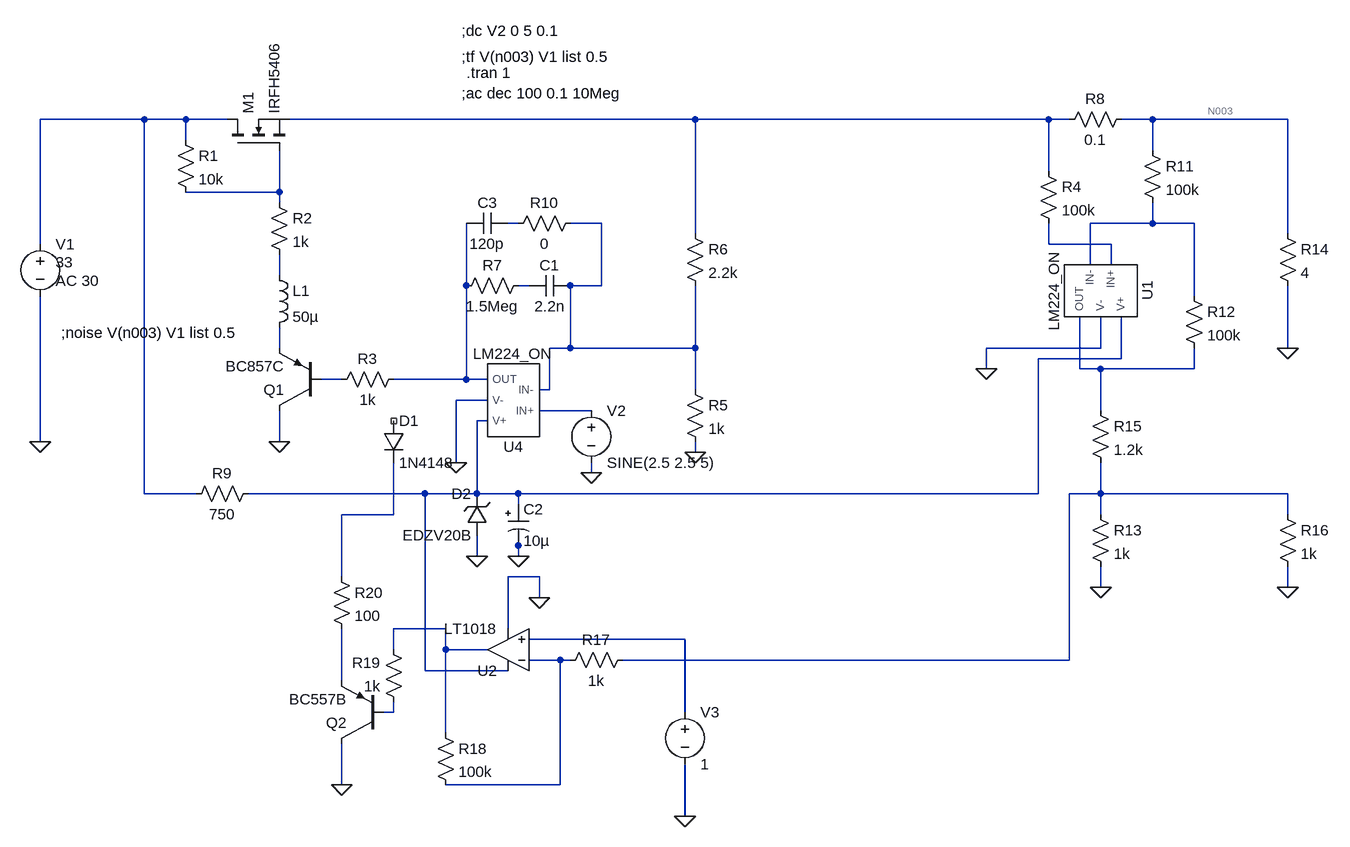
[diagram p0: schematic power_ac2.asc]
power_ac2.asc, the LTspice schematic file:
Version 4
SHEET 1 1520 1352
WIRE -672 96 -832 96
WIRE -608 96 -672 96
WIRE -544 96 -608 96
WIRE 176 96 -448 96
WIRE 720 96 176 96
WIRE 752 96 720 96
WIRE 880 96 832 96
WIRE 1088 96 880 96
WIRE -608 128 -608 96
WIRE 880 144 880 96
WIRE 720 176 720 96
WIRE -464 208 -464 144
WIRE -464 208 -608 208
WIRE -464 224 -464 208
WIRE -96 256 -112 256
WIRE 32 256 -16 256
WIRE 880 256 880 224
WIRE 880 256 784 256
WIRE 944 256 880 256
WIRE 176 272 176 96
WIRE 1088 272 1088 96
WIRE -832 288 -832 96
WIRE 720 288 720 256
WIRE 816 288 720 288
WIRE 784 320 784 256
WIRE 816 320 816 288
WIRE -464 336 -464 304
WIRE -176 352 -176 256
WIRE -80 352 -96 352
WIRE 32 352 32 256
WIRE 32 352 -16 352
WIRE 944 368 944 256
WIRE -464 448 -464 416
WIRE -16 448 -16 352
WIRE -16 448 -48 448
WIRE 176 448 176 352
WIRE 176 448 -16 448
WIRE 800 448 800 400
WIRE 800 448 624 448
WIRE 1088 448 1088 352
WIRE 832 464 832 400
WIRE 832 464 704 464
WIRE 624 480 624 448
WIRE 768 480 768 400
WIRE 800 480 768 480
WIRE 944 480 944 448
WIRE 944 480 800 480
WIRE -368 496 -400 496
WIRE -176 496 -176 352
WIRE -176 496 -288 496
WIRE -144 496 -176 496
WIRE -48 512 -48 448
WIRE -48 512 -64 512
WIRE 176 512 176 448
WIRE -144 528 -192 528
WIRE 16 544 -64 544
WIRE 800 544 800 480
WIRE -144 560 -160 560
WIRE -832 592 -832 368
WIRE -464 592 -464 544
WIRE 176 608 176 592
WIRE -192 624 -192 528
WIRE 16 640 16 624
WIRE -672 672 -672 96
WIRE -592 672 -672 672
WIRE -240 672 -512 672
WIRE -160 672 -160 560
WIRE -160 672 -240 672
WIRE -96 672 -160 672
WIRE 704 672 704 464
WIRE 704 672 -96 672
WIRE 800 672 800 624
WIRE 800 672 752 672
WIRE 1088 672 800 672
WIRE -96 688 -96 672
WIRE -288 704 -288 624
WIRE -288 704 -368 704
WIRE 800 704 800 672
WIRE 1088 704 1088 672
WIRE -96 752 -96 736
WIRE -160 768 -160 736
WIRE -96 768 -96 752
WIRE -368 800 -368 704
WIRE -64 800 -112 800
WIRE 800 816 800 784
WIRE 1088 816 1088 784
WIRE -64 832 -64 800
WIRE -208 880 -288 880
WIRE -112 880 -112 800
WIRE 160 896 -80 896
WIRE -288 912 -288 880
WIRE -208 912 -208 880
WIRE -144 912 -208 912
WIRE -32 928 -80 928
WIRE -16 928 -32 928
WIRE 752 928 752 672
WIRE 752 928 64 928
WIRE -240 944 -240 672
WIRE -112 944 -240 944
WIRE -368 960 -368 880
WIRE -288 1008 -288 992
WIRE -288 1008 -304 1008
WIRE 160 1008 160 896
WIRE -208 1040 -208 912
WIRE -368 1120 -368 1056
WIRE -32 1120 -32 928
WIRE -32 1120 -208 1120
WIRE 160 1168 160 1088
FLAG -464 592 0
FLAG -832 592 0
FLAG 16 640 0
FLAG -192 624 0
FLAG 176 608 0
FLAG -160 768 0
FLAG -96 768 0
FLAG 1088 448 0
FLAG 624 480 0
FLAG 800 816 0
FLAG 1088 816 0
FLAG 160 1168 0
FLAG -64 832 0
FLAG -368 1120 0
SYMBOL res -624 112 R0
SYMATTR InstName R1
SYMATTR Value 10k
SYMBOL res -480 208 R0
SYMATTR InstName R2
SYMATTR Value 1k
SYMBOL pnp -400 544 R180
SYMATTR InstName Q1
SYMATTR Value BC857C
SYMBOL res -272 480 R90
WINDOW 0 0 56 VBottom 2
WINDOW 3 32 56 VTop 2
SYMATTR InstName R3
SYMATTR Value 1k
SYMBOL voltage -832 272 R0
WINDOW 123 24 72 Left 2
WINDOW 39 0 0 Left 2
WINDOW 3 24 44 Left 2
SYMATTR Value2 AC 30
SYMATTR Value 33
SYMATTR InstName V1
SYMBOL voltage 16 528 R0
WINDOW 123 24 124 Left 2
WINDOW 39 0 0 Left 2
SYMATTR InstName V2
SYMATTR Value SINE(2.5 2.5 5)
SYMBOL nmos -544 144 R270
SYMATTR InstName M1
SYMATTR Value IRFH5406
SYMBOL res 160 496 R0
SYMATTR InstName R5
SYMATTR Value 1k
SYMBOL res 160 256 R0
SYMATTR InstName R6
SYMATTR Value 2.2k
SYMBOL res -80 336 R90
WINDOW 0 0 56 VBottom 2
WINDOW 3 32 56 VTop 2
SYMATTR InstName R7
SYMATTR Value 1.5Meg
SYMBOL cap -16 336 R90
WINDOW 0 0 32 VBottom 2
WINDOW 3 32 32 VTop 2
SYMATTR InstName C1
SYMATTR Value 2.2n
SYMBOL res 848 80 R90
WINDOW 0 0 56 VBottom 2
WINDOW 3 32 56 VTop 2
SYMATTR InstName R8
SYMATTR Value 0.1
SYMBOL res -496 656 R90
WINDOW 0 0 56 VBottom 2
WINDOW 3 32 56 VTop 2
SYMATTR InstName R9
SYMATTR Value 750
SYMBOL zener -144 736 R180
WINDOW 0 24 64 Left 2
WINDOW 3 24 0 Left 2
SYMATTR InstName D2
SYMATTR Value EDZV20B
SYMBOL polcap -112 688 R0
WINDOW 3 24 56 Left 2
SYMATTR Value 10µ
SYMATTR InstName C2
SYMATTR Description Capacitor
SYMATTR Type cap
SYMATTR SpiceLine V=6.3 Irms=0 Rser=4 Lser=0 mfg="AVX" pn="TAJA106M006" type="Tantalum"
SYMBOL cap -112 240 R90
WINDOW 0 0 32 VBottom 2
WINDOW 3 32 32 VTop 2
SYMATTR InstName C3
SYMATTR Value 120p
SYMBOL res 0 240 R90
WINDOW 0 0 56 VBottom 2
WINDOW 3 32 56 VTop 2
SYMATTR InstName R10
SYMATTR Value 0
SYMBOL ind -480 320 R0
SYMATTR InstName L1
SYMATTR Value 50µ
SYMBOL res 704 160 R0
SYMATTR InstName R4
SYMATTR Value 100k
SYMBOL res 864 128 R0
SYMATTR InstName R11
SYMATTR Value 100k
SYMBOL res 928 352 R0
SYMATTR InstName R12
SYMATTR Value 100k
SYMBOL res 784 688 R0
SYMATTR InstName R13
SYMATTR Value 1k
SYMBOL res 784 528 R0
SYMATTR InstName R15
SYMATTR Value 1.2k
SYMBOL res 1072 688 R0
SYMATTR InstName R16
SYMATTR Value 1k
SYMBOL res 80 912 R90
WINDOW 0 0 56 VBottom 2
WINDOW 3 32 56 VTop 2
SYMATTR InstName R17
SYMATTR Value 1k
SYMBOL voltage 160 992 R0
WINDOW 123 24 124 Left 2
WINDOW 39 0 0 Left 2
SYMATTR InstName V3
SYMATTR Value 1
SYMBOL res -224 1024 R0
SYMATTR InstName R18
SYMATTR Value 100k
SYMBOL AutoGenerated\\LM224_ON -96 528 R180
SYMATTR InstName U4
SYMBOL AutoGenerated\\LM224_ON 800 352 R90
SYMATTR InstName U1
SYMBOL res -272 1008 R180
WINDOW 0 36 76 Left 2
WINDOW 3 36 40 Left 2
SYMATTR InstName R19
SYMATTR Value 1k
SYMBOL res -384 784 R0
SYMATTR InstName R20
SYMATTR Value 100
SYMBOL pnp -304 1056 R180
SYMATTR InstName Q2
SYMATTR Value BC557B
SYMBOL diode -304 560 R0
SYMATTR InstName D1
SYMATTR Value 1N4148
SYMBOL Comparators\\LT1018 -112 912 R180
SYMATTR InstName U2
SYMBOL res 1072 256 R0
SYMATTR InstName R14
SYMATTR Value 4
TEXT -184 -40 Left 2 !;dc V2 0 5 0.1
TEXT -184 56 Left 2 !;ac dec 100 0.1 10Meg
TEXT -176 24 Left 2 !.tran 1
TEXT -184 0 Left 2 !;tf V(n003) V1 list 0.5
TEXT -800 424 Left 2 !;noise V(n003) V1 list 0.5

The netlist it stands for:
* power_ac2.asc
R1 N001 N004 10k
R2 N004 N009 1k
Q1 0 N015 N012 0 BC857C
R3 N010 N015 1k
V1 N001 0 33 AC 30
V2 N016 0 SINE(2.5 2.5 5)
M1 N001 N004 N002 N002 IRFH5406
R5 N006 0 1k
R6 N002 N006 2.2k
R7 N011 N010 1.5Meg
C1 N006 N011 2.2n
R8 N003 N002 0.1
R9 N013 N001 750
D2 0 N013 EDZV20B
C2 N013 0 10µ V=6.3 Irms=0 Rser=4 Lser=0 mfg="AVX" pn="TAJA106M006" type="Tantalum"
C3 N005 N010 120p
R10 N006 N005 0
L1 N009 N012 50µ
R4 N002 N008 100k
R11 N003 N007 100k
R12 N007 N014 100k
R13 N017 0 1k
R15 N014 N017 1.2k
R16 N017 0 1k
R17 N017 N021 1k
V3 N020 0 1
R18 N019 N021 100k
XU4 N016 N006 N013 0 N010 LM224_ON  ; pins IN+ IN- V+ V- OUT
XU1 N008 N007 N013 0 N014 LM224_ON  ; pins IN+ IN- V+ V- OUT
R19 N023 N019 1k
R20 N018 N022 100
Q2 0 N023 N022 0 BC557B
D1 NC_01 N018 1N4148
XU2 N020 N021 N013 0 N019 LT1018  ; pins In+ In- V+ V- OUT
R14 N003 0 4
.model D D
.lib standard.dio
.model NPN NPN
.model PNP PNP
.lib standard.bjt
.model NMOS NMOS
.model PMOS PMOS
.lib standard.mos
;dc V2 0 5 0.1
;ac dec 100 0.1 10Meg
.tran 1
;tf V(n003) V1 list 0.5
;noise V(n003) V1 list 0.5
.lib C:\Users\uidl9506\Downloads\LM224 PSPICE MODEL.MOD
.lib LTC1.lib
.backanno
.end